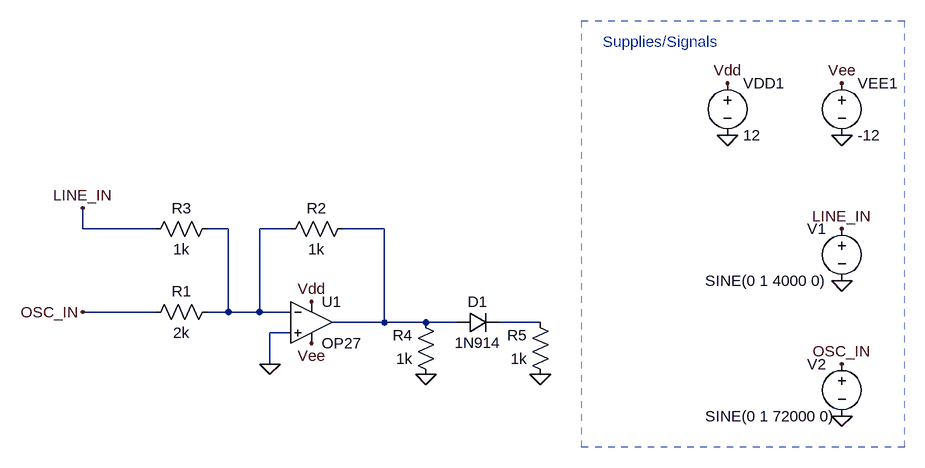
[diagram p0: schematic Draft4.asc]
Draft4.asc, the LTspice schematic file:
Version 4
SHEET 1 1044 900
WIRE -224 96 -224 64
WIRE -112 96 -224 96
WIRE 0 96 -32 96
WIRE 96 96 48 96
WIRE 240 96 176 96
WIRE -112 224 -224 224
WIRE 0 224 0 96
WIRE 0 224 -32 224
WIRE 48 224 48 96
WIRE 48 224 0 224
WIRE 96 224 48 224
WIRE 240 240 240 96
WIRE 240 240 160 240
WIRE 304 240 240 240
WIRE 352 240 304 240
WIRE 480 240 416 240
WIRE 96 256 64 256
WIRE 64 304 64 256
FLAG 304 320 0
FLAG 480 320 0
FLAG -224 64 LINE_IN
FLAG 64 304 0
FLAG 128 208 Vdd
FLAG 128 272 Vee
FLAG 768 -48 0
FLAG 944 -48 0
FLAG 768 -128 Vdd
FLAG 944 -128 Vee
FLAG 944 176 0
FLAG 944 96 LINE_IN
FLAG 944 384 0
FLAG 944 304 OSC_IN
FLAG -224 224 OSC_IN
SYMBOL res -16 208 R90
WINDOW 0 0 56 VBottom 2
WINDOW 3 32 56 VTop 2
SYMATTR InstName R1
SYMATTR Value 2k
SYMBOL res 192 80 R90
WINDOW 0 0 56 VBottom 2
WINDOW 3 32 56 VTop 2
SYMATTR InstName R2
SYMATTR Value 1k
SYMBOL res -16 80 R90
WINDOW 0 0 56 VBottom 2
WINDOW 3 32 56 VTop 2
SYMATTR InstName R3
SYMATTR Value 1k
SYMBOL res 320 336 R180
WINDOW 0 36 76 Left 2
WINDOW 3 36 40 Left 2
SYMATTR InstName R4
SYMATTR Value 1k
SYMBOL res 496 336 R180
WINDOW 0 36 76 Left 2
WINDOW 3 36 40 Left 2
SYMATTR InstName R5
SYMATTR Value 1k
SYMBOL Opamps\\OP27 128 176 R0
SYMATTR InstName U1
SYMBOL diode 352 256 R270
WINDOW 0 32 32 VTop 2
WINDOW 3 0 32 VBottom 2
SYMATTR InstName D1
SYMATTR Value 1N914
SYMBOL voltage 768 -144 R0
SYMATTR InstName VDD1
SYMATTR Value 12
SYMBOL voltage 944 -144 R0
SYMATTR InstName VEE1
SYMATTR Value -12
SYMBOL voltage 944 80 M0
WINDOW 3 210 96 Right 2
WINDOW 123 0 0 Left 0
WINDOW 39 0 0 Left 0
SYMATTR Value SINE(0 1 4000 0)
SYMATTR InstName V1
SYMBOL voltage 944 288 M0
WINDOW 3 210 96 Right 2
WINDOW 123 0 0 Left 0
WINDOW 39 0 0 Left 0
SYMATTR Value SINE(0 1 72000 0)
SYMATTR InstName V2
TEXT 576 -192 Left 2 ;Supplies/Signals
RECTANGLE Normal 1040 432 544 -224 2

The netlist it stands for:
* Draft4.asc
R1 N001 OSC_IN 2k
R2 N002 N001 1k
R3 N001 LINE_IN 1k
R4 0 N002 1k
R5 0 N003 1k
XU1 0 N001 Vdd Vee N002 OP27  ; pins In+ In- V+ V- OUT
D1 N002 N003 1N914
VDD1 Vdd 0 12
VEE1 Vee 0 -12
V1 LINE_IN 0 SINE(0 1 4000 0)
V2 OSC_IN 0 SINE(0 1 72000 0)
.model D D
.lib standard.dio
* Supplies/Signals
.lib ADI.lib
.backanno
.end